# Altium schematic sheet Flyback.SchDoc (part 1 of 3)
size A4
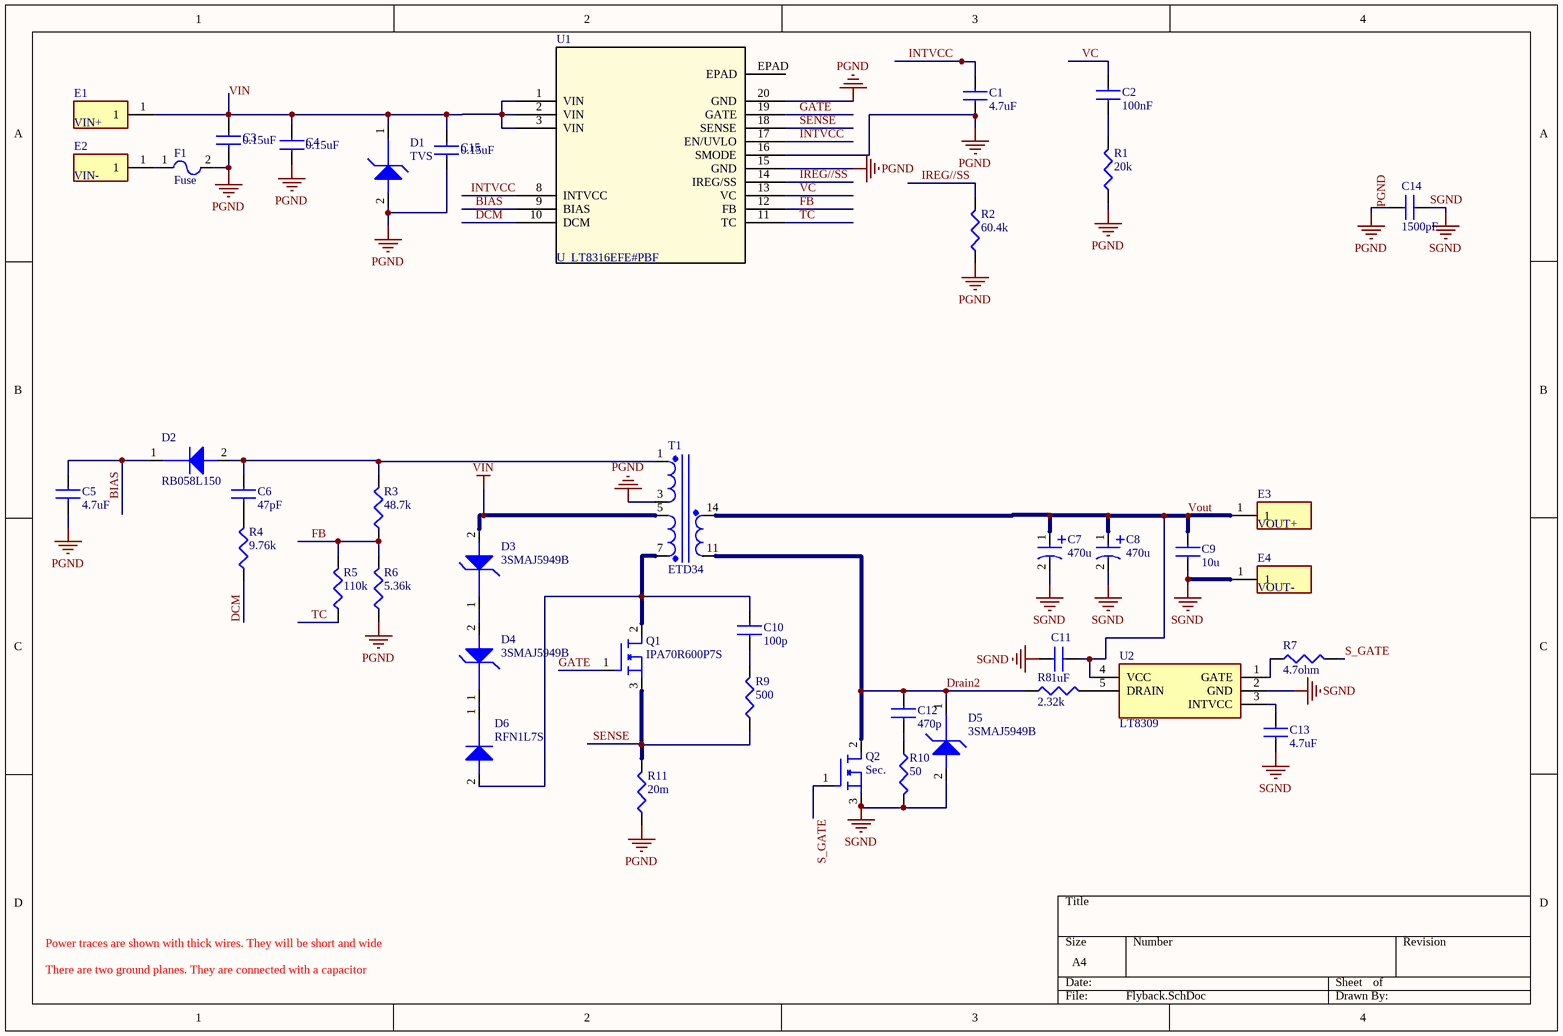
[diagram p0: Flyback.SchDoc]

## Parts
C1  4.7uF  [C0805]
C2  100nF  [C0402]
C3  0.15uF  [C1210]
C4  0.15uF  [C1210]
C5  4.7uF  [C0805]
C6  47pF  [C0603]
C7  470u  [C6.3x12]
C8  470u  [C6.3x12]
C9  10u  [C0805]
C10  100p  [C1206]
C11  1uF  [C0805]
C12  470p  [C0402]
C13  4.7uF  [CAPC2012X145N]
C14  1500pF  [SMDY1102MY5UCB]
C15  0.15uF  [C1210]
D1  TVS  [D_TVS]
D2  RB058L150  [SOD128]
D3  3SMAJ5949B  [DO214_AC_SMA]
D4  3SMAJ5949B  [DO214_AC_SMA]
D5  3SMAJ5949B  [DO214_AC_SMA]
D6  RFN1L7S  [DO214_AC_SMA]
E1  VIN+  [MILMAX_2501-2-00-80-00-00-07-0]
E2  VIN-  [MILMAX_2501-2-00-80-00-00-07-0]
E3  VOUT+  [MILMAX_2501-2-00-80-00-00-07-0]
E4  VOUT-  [MILMAX_2501-2-00-80-00-00-07-0]
F1  Fuse  [Fuse]
Q1  IPA70R600P7S  [TO220_FullPAK]
Q2  Sec.  [BSC040N10NS5ATMA1]
R1  20k  [R0603]
R2  60.4k  [R0603]
R3  48.7k  [R0603]
R4  9.76k  [R0603]
R5  110k  [R0603]
R6  5.36k  [R0603]
R7  4.7ohm  [R0603]
R8  2.32k  [R0603]
R9  500  [R2512]
R10  50  [R0603]
R11  20m  [R1220]
T1  ETD34  [ETD34_CoilFormer]
U1  U_LT8316EFE#PBF  [LT8316EFE]
U2  LT8309  [SOT95P280X100-5N]

## Nets
PGND: C1.1 C3.1 C4.1 C5.1 C14.1 C15.1 D1.2 F1.2 R1.1 R2.1 R6.1 R11.1 T1.3 U1.15(GND) U1.16(SMODE) U1.20(GND)
SGND: C7.2 C8.2 C9.1 C11.1 C13.1 C14.2 D5.2 E4.1 Q2.3 R10.2 U2.2(GND)
VIN: C3.2 C4.2 C15.2 D1.1 D3.2 E1.1 T1.5 U1.1(VIN) U1.2(VIN) U1.3(VIN)
BIAS: C5.2 D2.1 U1.9(BIAS)
DCM: R4.1 U1.10(DCM)
Drain2: C12.1 D5.1 Q2.2 R8.1 T1.11
FB: R3.1 R5.2 R6.2 U1.12(FB)
GATE: Q1.1 U1.19(GATE)
INTVCC: C1.2 U1.8(INTVCC) U1.17(EN/UVLO)
IREG//SS: R2.2 U1.14(IREG/SS)
S_GATE: Q2.1 R7.2
SENSE: Q1.3 R9.1 R11.2 U1.18(SENSE)
TC: R5.1 U1.11(TC)
VC: C2.2 U1.13(VC)
Vout: C7.1 C8.1 C9.2 C11.2 E3.1 T1.14 U2.4(VCC)
NetC2_1: C2.1 R1.2
NetC6_1: C6.1 R4.2
NetC6_2: C6.2 D2.2 R3.2 T1.1
NetC10_1: C10.1 R9.2
NetC10_2: C10.2 D6.2 Q1.2 T1.7
NetC12_2: C12.2 R10.1
NetC13_2: C13.2 U2.3(INTVCC)
NetD3_1: D3.1 D4.2
NetD4_1: D4.1 D6.1
NetE2_1: E2.1 F1.1
NetR7_1: R7.1 U2.1(GATE)
NetR8_2: R8.2 U2.5(DRAIN)

Not connected (* = marked no-connect by the designer): U1 EPAD

## Notes on the sheet
- Power traces are shown with thick wires. They will be short and wide
- There are two ground planes. They are connected with a capacitor